# Altium schematic sheet IOs.SchDoc
size A4; SheetNumber: 3; SheetTotal: 9
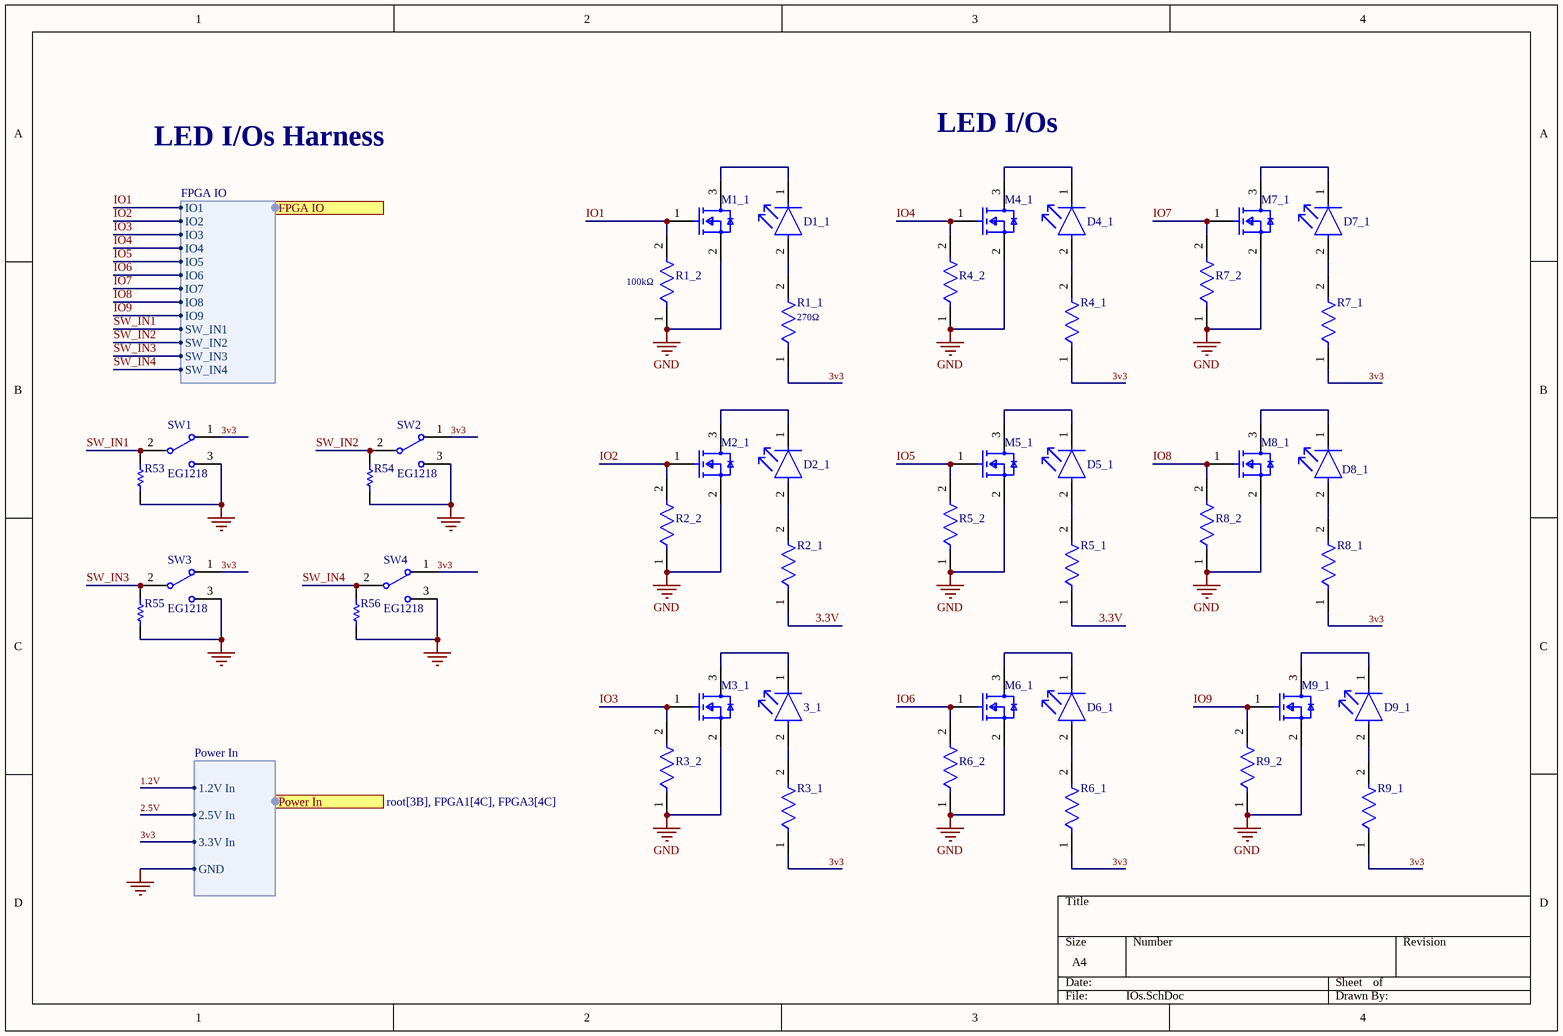
[diagram p0: IOs.SchDoc]

## Parts
3_1  LW T6SH.CB-CZEY-FK0PM0-Z664  [FP-LW_T6SH_CB-CZEY-FK0PM0-MFG]  (value not drawn)
D1_1  LW T6SH.CB-CZEY-FK0PM0-Z664  [FP-LW_T6SH_CB-CZEY-FK0PM0-MFG]  (value not drawn)
D2_1  LW T6SH.CB-CZEY-FK0PM0-Z664  [FP-LW_T6SH_CB-CZEY-FK0PM0-MFG]  (value not drawn)
D4_1  LW T6SH.CB-CZEY-FK0PM0-Z664  [FP-LW_T6SH_CB-CZEY-FK0PM0-MFG]  (value not drawn)
D5_1  LW T6SH.CB-CZEY-FK0PM0-Z664  [FP-LW_T6SH_CB-CZEY-FK0PM0-MFG]  (value not drawn)
D6_1  LW T6SH.CB-CZEY-FK0PM0-Z664  [FP-LW_T6SH_CB-CZEY-FK0PM0-MFG]  (value not drawn)
D7_1  LW T6SH.CB-CZEY-FK0PM0-Z664  [FP-LW_T6SH_CB-CZEY-FK0PM0-MFG]  (value not drawn)
D8_1  LW T6SH.CB-CZEY-FK0PM0-Z664  [FP-LW_T6SH_CB-CZEY-FK0PM0-MFG]  (value not drawn)
D9_1  LW T6SH.CB-CZEY-FK0PM0-Z664  [FP-LW_T6SH_CB-CZEY-FK0PM0-MFG]  (value not drawn)
M1_1  SI2342DS-T1-GE3  [FP-S-03946-MFG]  (value not drawn)
M2_1  SI2342DS-T1-GE3  [FP-S-03946-MFG]  (value not drawn)
M3_1  SI2342DS-T1-GE3  [FP-S-03946-MFG]  (value not drawn)
M4_1  SI2342DS-T1-GE3  [FP-S-03946-MFG]  (value not drawn)
M5_1  SI2342DS-T1-GE3  [FP-S-03946-MFG]  (value not drawn)
M6_1  SI2342DS-T1-GE3  [FP-S-03946-MFG]  (value not drawn)
M7_1  SI2342DS-T1-GE3  [FP-S-03946-MFG]  (value not drawn)
M8_1  SI2342DS-T1-GE3  [FP-S-03946-MFG]  (value not drawn)
M9_1  SI2342DS-T1-GE3  [FP-S-03946-MFG]  (value not drawn)
R1_1  270Ω  [FP-CR0402-IPC_A]
R1_2  100kΩ  [FP-TFCR0402-IPC_B]
R2_1  CR0402-JW-271GLF  [FP-CR0402-IPC_A]  (value not drawn)
R2_2  100kΩ  [FP-TFCR0402-IPC_B]  (value not drawn)
R3_1  CR0402-JW-271GLF  [FP-CR0402-IPC_A]  (value not drawn)
R3_2  100kΩ  [FP-TFCR0402-IPC_B]  (value not drawn)
R4_1  CR0402-JW-271GLF  [FP-CR0402-IPC_A]  (value not drawn)
R4_2  100kΩ  [FP-TFCR0402-IPC_B]  (value not drawn)
R5_1  CR0402-JW-271GLF  [FP-CR0402-IPC_A]  (value not drawn)
R5_2  100kΩ  [FP-TFCR0402-IPC_B]  (value not drawn)
R6_1  CR0402-JW-271GLF  [FP-CR0402-IPC_A]  (value not drawn)
R6_2  100kΩ  [FP-TFCR0402-IPC_B]  (value not drawn)
R7_1  CR0402-JW-271GLF  [FP-CR0402-IPC_A]  (value not drawn)
R7_2  100kΩ  [FP-TFCR0402-IPC_B]  (value not drawn)
R8_1  CR0402-JW-271GLF  [FP-CR0402-IPC_A]  (value not drawn)
R8_2  100kΩ  [FP-TFCR0402-IPC_B]  (value not drawn)
R9_1  CR0402-JW-271GLF  [FP-CR0402-IPC_A]  (value not drawn)
R9_2  100kΩ  [FP-TFCR0402-IPC_B]  (value not drawn)
R53  3K3 5% 0603(1608)  [RESC0603(1608)_N]  (value not drawn)
R54  3K3 5% 0603(1608)  [RESC0603(1608)_N]  (value not drawn)
R55  3K3 5% 0603(1608)  [RESC0603(1608)_N]  (value not drawn)
R56  3K3 5% 0603(1608)  [RESC0603(1608)_N]  (value not drawn)
SW1  EG1218  [ESWI-EG1218_V]
SW2  EG1218  [ESWI-EG1218_V]
SW3  EG1218  [ESWI-EG1218_V]
SW4  EG1218  [ESWI-EG1218_V]

## Ports
FPGA IO (harness FPGA IO, see root[4B], FPGA2[3A]), Power In (harness Power In, see root[3B], FPGA1[4C], FPGA3[4C])

## Harnesses
FPGA IO: IO1, IO2, IO3, IO4, IO5, IO6, IO7, IO8, IO9, SW_IN1, SW_IN2, SW_IN3, SW_IN4
Power In: 1.2V In, 2.5V In, 3.3V In, GND

## Nets
GND: M1_1.2(S) M2_1.2(S) M3_1.2(S) M4_1.2(S) M5_1.2(S) M6_1.2(S) M7_1.2(S) M8_1.2(S) M9_1.2(S) R1_2.1 R2_2.1 R3_2.1 R4_2.1 R5_2.1 R6_2.1 R7_2.1 R8_2.1 R9_2.1 R53.1 R54.1 R55.1 R56.1 SW1.3 SW2.3 SW3.3 SW4.3 ; port Power In.GND
1.2V: port Power In.1.2V In
2.5V: port Power In.2.5V In
3.3V: R2_1.1 R5_1.1
3v3: R1_1.1 R3_1.1 R4_1.1 R6_1.1 R7_1.1 R8_1.1 R9_1.1 SW1.1 SW2.1 SW3.1 SW4.1 ; port Power In.3.3V In
IO1: M1_1.1(G) R1_2.2 ; port FPGA IO.IO1
IO2: M2_1.1(G) R2_2.2 ; port FPGA IO.IO2
IO3: M3_1.1(G) R3_2.2 ; port FPGA IO.IO3
IO4: M4_1.1(G) R4_2.2 ; port FPGA IO.IO4
IO5: M5_1.1(G) R5_2.2 ; port FPGA IO.IO5
IO6: M6_1.1(G) R6_2.2 ; port FPGA IO.IO6
IO7: M7_1.1(G) R7_2.2 ; port FPGA IO.IO7
IO8: M8_1.1(G) R8_2.2 ; port FPGA IO.IO8
IO9: M9_1.1(G) R9_2.2 ; port FPGA IO.IO9
SW_IN1: R53.2 SW1.2(COM) ; port FPGA IO.SW_IN1
SW_IN2: R54.2 SW2.2(COM) ; port FPGA IO.SW_IN2
SW_IN3: R55.2 SW3.2(COM) ; port FPGA IO.SW_IN3
SW_IN4: R56.2 SW4.2(COM) ; port FPGA IO.SW_IN4
Net3_1_1: 3_1.1(C) M3_1.3(D)
Net3_1_2: 3_1.2(A) R3_1.2
NetD1_1_1: D1_1.1(C) M1_1.3(D)
NetD1_1_2: D1_1.2(A) R1_1.2
NetD2_1_1: D2_1.1(C) M2_1.3(D)
NetD2_1_2: D2_1.2(A) R2_1.2
NetD4_1_1: D4_1.1(C) M4_1.3(D)
NetD4_1_2: D4_1.2(A) R4_1.2
NetD5_1_1: D5_1.1(C) M5_1.3(D)
NetD5_1_2: D5_1.2(A) R5_1.2
NetD6_1_1: D6_1.1(C) M6_1.3(D)
NetD6_1_2: D6_1.2(A) R6_1.2
NetD7_1_1: D7_1.1(C) M7_1.3(D)
NetD7_1_2: D7_1.2(A) R7_1.2
NetD8_1_1: D8_1.1(C) M8_1.3(D)
NetD8_1_2: D8_1.2(A) R8_1.2
NetD9_1_1: D9_1.1(C) M9_1.3(D)
NetD9_1_2: D9_1.2(A) R9_1.2

## Notes on the sheet
- LED I/Os Harness
- LED I/Os

## Library data of the parts
3_1 D1_1 D2_1 D4_1 D5_1 D6_1 D7_1 D8_1 D9_1 = CMP-62016-000075-1: TOPLED
M1_1 M2_1 M3_1 M4_1 M5_1 M6_1 M7_1 M8_1 M9_1 = CMP-02550-000018-1: MOSFET N-CH 8V 6A SOT-23; Manufacturer: Vishay; Number Of N Channels: 1; Pulse Drain Current: 30A; Reverse Recovery Charge: 17nC; Depletion Mode: False; Reverse Recovery Time: 40ns; Max Junction Temp: +150°C; Power Dissipation: 1.3W; Transconductance: 75S; Threshold Vgs Min: 0.35V; Turn Off Delay Time: 65ns; Rthja Max: 75°C/W; Input Capacitace At Vds: 1070pF @ 4V; Gate Charge At Vgs: 10.5nC @ 4.5V; Gate To Source Voltage: 5V; Turn On Delay Time: 6ns; Drain To Source Resistance: 0.014Ω; Typ Forward Diode Voltage: 0.82V; Standoff Height: 0.01mm; Max Forward Diode Voltage: 1.2V; Threshold Vgs Max: 0.8V; Continuous Drain Current: 6A; Device Class L1: Discrete Semiconductors; Mouser Description: MOSFET 8V 6A 2.5; Category: Trans; Digikey Description: MOSFET N-CH 8V 6A SOT-23; Manufacturer Part Number: SI2342DS-T1-GE3; Device Class L2: Transistors; Octopart: https://octopart.com/si2342ds-t1-ge3-vishay-45050957; ComponentLink2URL: https://www.vishay.com/docs/63302/si2342ds.pdf; RoHS: TRUE; Drain To Source Breakdown Voltage: 8V; Height: 1.12mm; Lead Free: Yes; Temperature Range Low: -55°C; Package: S-03946; Device Class L3: MOSFETs; Temperature Range High: +150°C; Ipc Land Pattern Name: SOT95P237X100-3; Drain To Source Voltage: 8V; Temperature: -55°C to +150°C; ComponentLink2Description: Datasheet; Number Of Channels: 1; Automotive: No
R1_1 R2_1 R3_1 R4_1 R5_1 R6_1 R7_1 R8_1 R9_1 = CMP-2002-05589-2: Thick Film Chip Resistors 0402 270Ω 0.0625W 5% 200ppm/°C; Voltage Rating: 50V; Power Rating: 62.5mW; Resistance: 270R; Composition: Thick Film; Tolerance: 5%; Military Standard: Not; Temperature Coefficient: 200ppm/°C; Width: 0.5mm; Case/Package: 0402; Thickness: 356um; Termination: SMD/SMT; Case Code (Imperial): 0402; Contact Plating: Tin; Max Operating Temperature: 125°C; Packaging: Tape and Reel; Package Quantity: 10000; Length: 1mm; Min Operating Temperature: -55°C; Height: 0.35mm; Case Code (Metric): 1005; Mount: Surface Mount; Radiation Hardening: No; Depth: 0.5mm
R1_2 R2_2 R3_2 R4_2 R5_2 R6_2 R7_2 R8_2 R9_2 = CMP-250906-202248-1: RES Thin Film,  100kΩ, 0.5%, 0.063W, 25ppm/°C, 0402
R53-R56 = CMP-1012-00086-1: 3K3 0.1W 5% 0603 (1608 Metric)  SMD; Case-EIA: 0603; Value: 3300.00 Ohm; Case-Metric: 1608; Technology: SMT; Tolerance: 5 %; Power: 0.1 W
SW1-SW4 = CMP-1696-00002-1: Slide Switch, 500 V, -20 to 70 degC, 3-Pin THD, RoHS; Case\Package: SOT-23-5; Output Current: 150 mA; Nominal Output Voltage: 3.3 V; Max Power Dissipation: 250 mW; Min Input Voltage: 4.3 V; Outputs: 1; Max Input Voltage: 8 V; Dropout Voltage: 300 mV; PackageDescription: 3-Pin Through Hole Device, Body 11.6 x 4 mm, Pitch 2.5 mm; ComponentLink1URL: http://www.e-switch.ch/en/; RoHSCompliant: true; Length: 3 mm; ComponentLink1Description: Manufacturer URL; Power Rating: 250 mW; Mount: Surface Mount; Max Operating Temperature: 85 degC; REACH SVHC: No SVHC; Radiation Hardening: No; Height: 1.3 mm; Pins: 5; Max Ouput Current: 150 mA; Output Voltage: 3.3 V; Width: 1.8 mm; Package Quantity: 3000; ComponentLink2URL: https://www.e-switch.com/system/asset/product_line/data_sheet/119/EG.pdf; Min Operating Temperature: -40 degC; ComponentLink2Description: Datasheet; DatasheetVersion: Oct-15; PackageReference: EG1218; Packaging: Tape and Reel